# Altium schematic sheet JacDacRHTemp_Panel.SchDoc: JacDac RHTemp Panel
size A4; DrawnBy: Chandler Keep; DocumentNumber: 1/1; Revision: 1.1; SheetNumber: 2; SheetTotal: 2
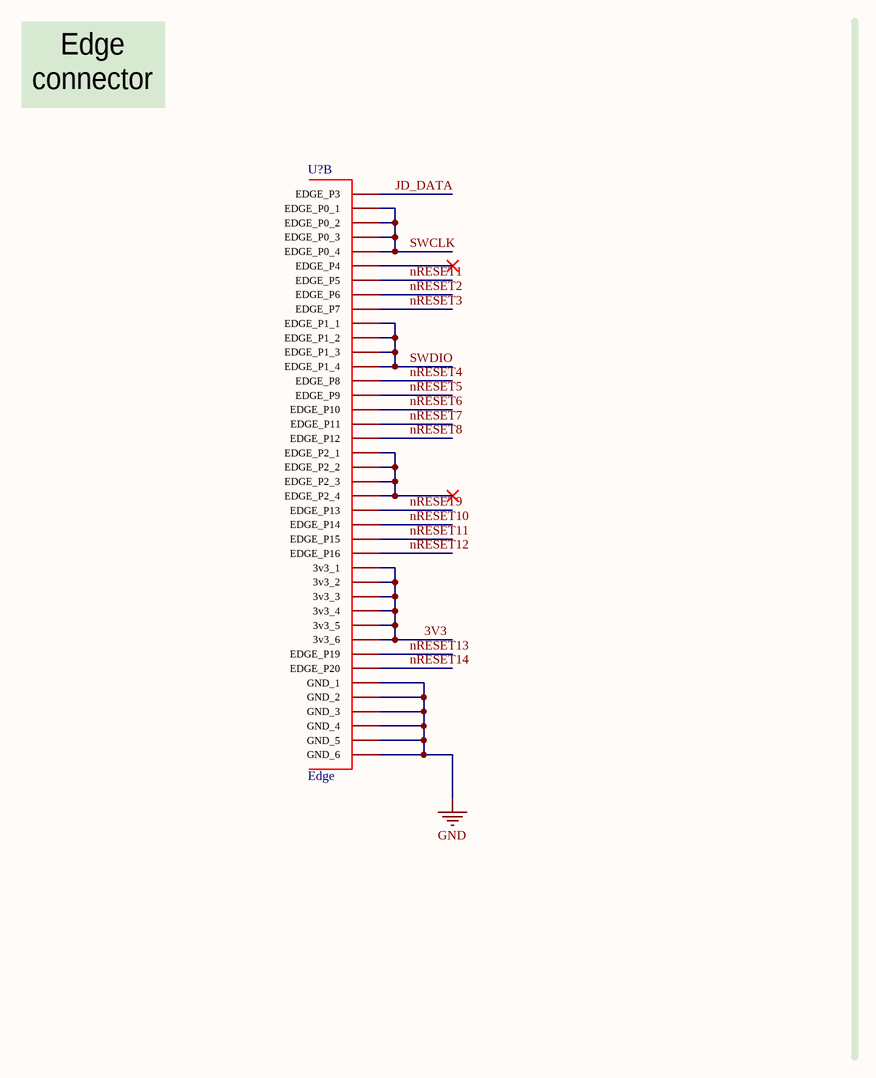
[diagram p0: JacDacRHTemp_Panel.SchDoc]

## Parts
U?  Edge  [PCB Edge]  (part B of 2)

## Nets
GND: U?.GND_1 U?.GND_2 U?.GND_3 U?.GND_4 U?.GND_5 U?.GND_6
3V3: U?.3v3_1 U?.3v3_2 U?.3v3_3 U?.3v3_4 U?.3v3_5 U?.3v3_6
JD_DATA: U?.P3(EDGE_P3)
nRESET1: U?.P5(EDGE_P5)
nRESET2: U?.P6(EDGE_P6)
nRESET3: U?.P7(EDGE_P7)
nRESET4: U?.P8(EDGE_P8)
nRESET5: U?.P9(EDGE_P9)
nRESET6: U?.P10(EDGE_P10)
nRESET7: U?.P11(EDGE_P11)
nRESET8: U?.P12(EDGE_P12)
nRESET9: U?.P13(EDGE_P13)
nRESET10: U?.P14(EDGE_P14)
nRESET11: U?.P15(EDGE_P15)
nRESET12: U?.P16(EDGE_P16)
nRESET13: U?.P19(EDGE_P19)
nRESET14: U?.P20(EDGE_P20)
SWCLK: U?.P0_1(EDGE_P0_1) U?.P0_2(EDGE_P0_2) U?.P0_3(EDGE_P0_3) U?.P0_4(EDGE_P0_4)
SWDIO: U?.P1_1(EDGE_P1_1) U?.P1_2(EDGE_P1_2) U?.P1_3(EDGE_P1_3) U?.P1_4(EDGE_P1_4)
NetU?_P2_1: U?.P2_1(EDGE_P2_1) U?.P2_2(EDGE_P2_2) U?.P2_3(EDGE_P2_3) U?.P2_4(EDGE_P2_4)

Not connected (* = marked no-connect by the designer): U? P4(EDGE_P4)*

## Notes on the sheet
- Edge
  connector

## Library data of the parts
U? = Edge: Microbit edge connector